# Altium project Arduino Mega 2560.PrjPcb
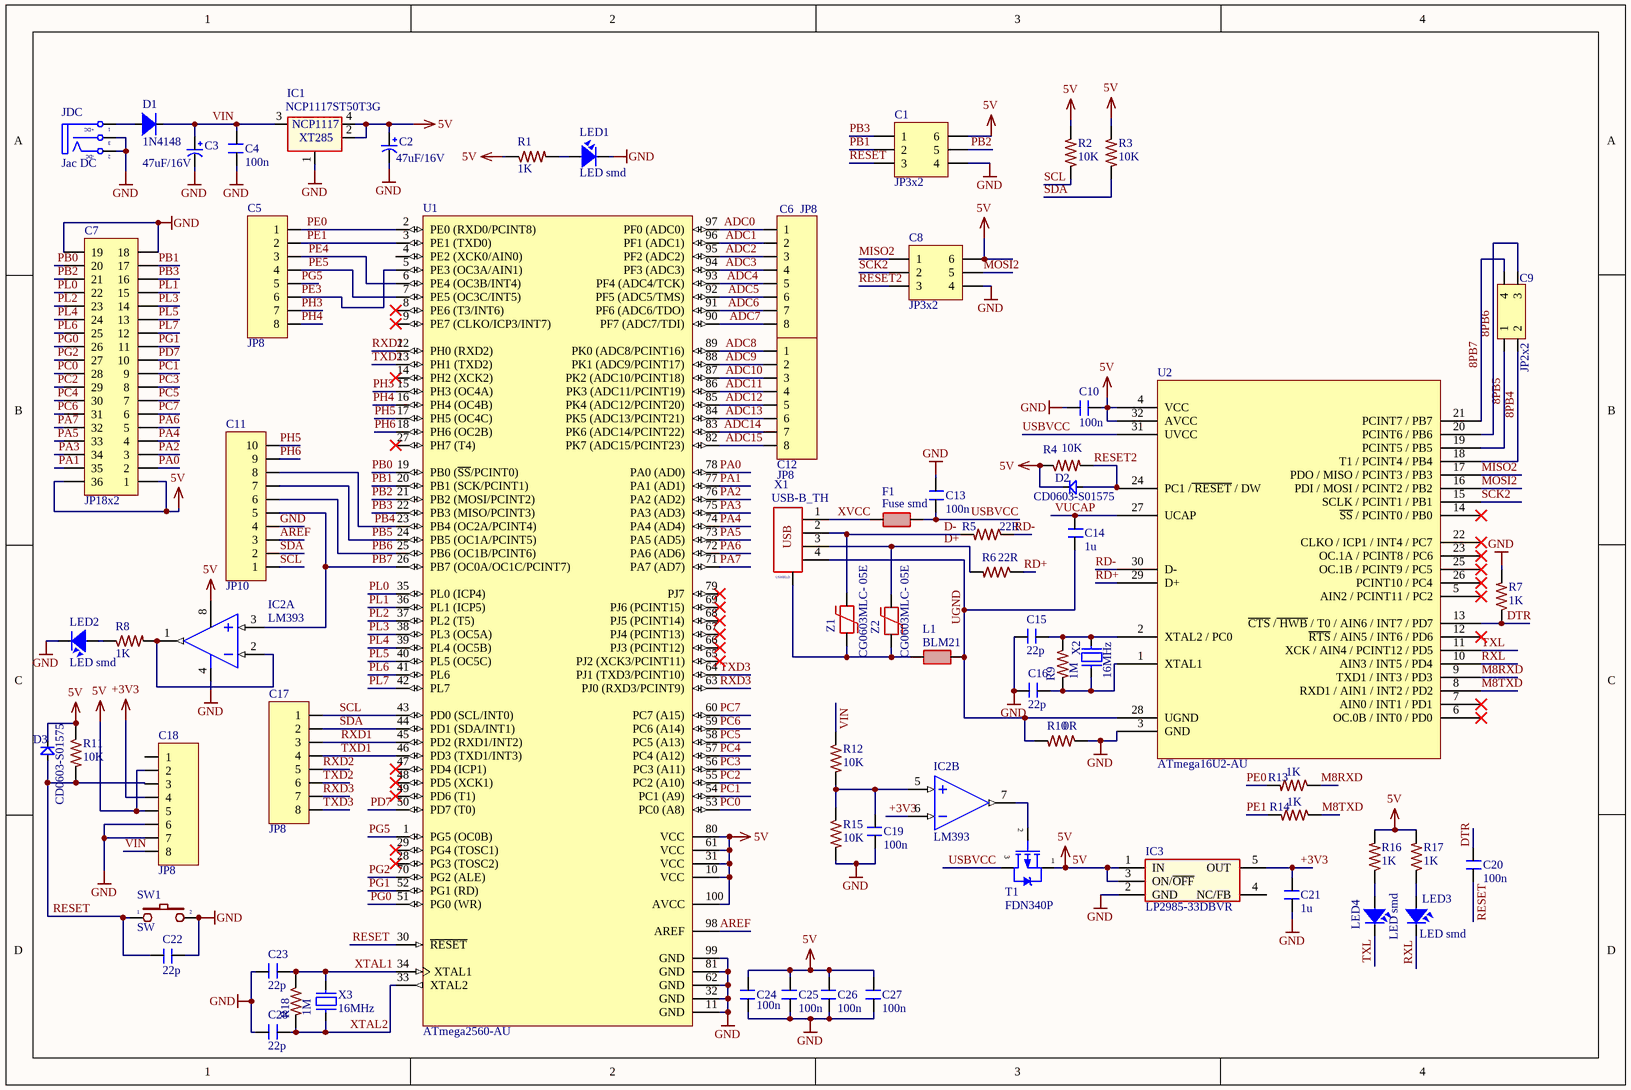
[diagram p0: Sheet_Arduino_Mega_2560.SchDoc]
1 sheet, 68 parts. Net scope: global (net labels, ports and power ports of the same name join across sheets).
Board file: PCB_Arduino_Mega_2560_new.PcbDoc

## Sheet Sheet_Arduino_Mega_2560.SchDoc: Arduino Mega 2560
size 304 x 203 mm; Author: Võ Thái Linh; Organization: HUST; Address1: Số 2, ngõ 17, Lê Thanh Nghị; Address2: Hai Bà Trưng, Hà Nội; Address3: NSW; Address4: Australia 2086; Rule: UNIONINDEX=0|RULEKIND=Clearance|NETSCOPE=DifferentNets|LAYERKIND=SameLayer|NAME=Schematic Clearance Constraint|GAP=10mil|GENERICCLEARANCE=10mil|IGNOREPADTOPADCLEARANCEINFOOTPRINT=FALSE|OBJECTCLEARANCES=ClearanceObj_Arc-ClearanceObj_Hole:0;ClearanceObj_Track-ClearanceObj_Hole:0;ClearanceObj_SMDPad-ClearanceObj_Hole:0;ClearanceObj_THPad-ClearanceObj_Hole:0;ClearanceObj_Via-ClearanceObj_Hole:0;ClearanceObj_Fill-ClearanceObj_Hole:0;ClearanceObj_Poly-ClearanceObj_Hole:0;ClearanceObj_Region-ClearanceObj_Hole:0;ClearanceObj_Text-ClearanceObj_Hole:0|UNIT=Imperial

### Parts
C1  JP3x2  [JP3-D2T]
C2  47uF/16V  [CAP-ALU-SMD-F]
C3  47uF/16V  [CAP-ALU-SMD-F]
C4  100n  [cap 0603]
C5  JP8  [JP8-C1T]
C6  JP8  [JP8-C1T]
C7  JP18x2  [JP18-C2T]
C8  JP3x2  [JP3-D2T]
C9  JP2x2  [JP2-D2T]
C10  100n  [cap 0603]
C11  JP10  [JP10-C1T]
C12  JP8  [JP8-C1T]
C13  100n  [cap 0603]
C14  1u  [cap 0603]
C15  22p  [cap 0603]
C16  22p  [cap 0603]
C17  JP8  [JP8-C1T]
C18  JP8  [JP8-C1T]
C19  100n  [cap 0603]
C20  100n  [cap 0603]
C21  1u  [cap 0603]
C22  22p  [cap 0603]
C23  22p  [cap 0603]
C24  100n  [cap 0603]
C25  100n  [cap 0603]
C26  100n  [cap 0603]
C27  100n  [cap 0603]
C28  22p  [cap 0603]
D1  1N4148  [SOD80_lib]
D2  CD0603-S01575  [CD0603-S01575]
D3  CD0603-S01575  [CD0603-S01575]
F1  Fuse smd  [Fuse_smd]
IC1  NCP1117ST50T3G  [SOT223-4M_apes]
IC2  LM393  [LM393]  (parts A,B of 2)
IC3  LP2985-33DBVR  [SOT23-5]
JDC  Jac DC  [DC0]
L1  BLM21  [BLM21]
LED1  LED smd  [LED-0805-Yellow]
LED2  LED smd  [LED-0805-Red]
LED3  LED smd  [LED-0805-Yellow]
LED4  LED smd  [LED-0805-Yellow]
R1  1K  [RES-SMD-0603]
R2  10K  [RES-SMD-0603]
R3  10K  [RES-SMD-0603]
R4  10K  [RES-SMD-0603]
R5  22R  [RES-SMD-0603]
R6  22R  [RES-SMD-0603]
R7  1K  [RES-SMD-0603]
R8  1K  [RES-SMD-0603]
R9  1M  [RES-SMD-0603]
R10  0R  [RES-SMD-0603]
R11  10K  [RES-SMD-0603]
R12  10K  [RES-SMD-0603]
R13  1K  [RES-SMD-0603]
R14  1K  [RES-SMD-0603]
R15  10K  [RES-SMD-0603]
R16  1K  [RES-SMD-0603]
R17  1K  [RES-SMD-0603]
R18  1M  [RES-SMD-0603]
SW1  SW  [SW-SMD_apes]
T1  FDN340P  [SOT23-231]
U1  ATmega2560-AU  [TQFP100L]
U2  ATmega16U2-AU  [TQFP32]
X1  USB-B_TH  [USB-C2]
X2  16MHz  [XT2-32.768KHz-2_V]
X3  16MHz  [XT2-32.768KHz-2_V]
Z1  CG0603MLC- 05E  [CG0603MLC- 05E]
Z2  CG0603MLC- 05E  [CG0603MLC- 05E]

### Nets
5V: C1.6 C2.1 C7.1 C7.36 C8.6 C10.1 C18.2 C18.5 C24.2 C25.2 C26.2 C27.2 D2.2(K) D3.2(K) IC1.2 IC1.4 IC2.8(+V) IC3.1(IN) IC3.3(ON/~{OFF}) R1.1 R2.1 R3.1 R4.1 R11.1 R16.2 R17.2 T1.1(S) U1.10(VCC) U1.31(VCC) U1.61(VCC) U1.80(VCC) U1.100(AVCC) U2.4(VCC) U2.32(AVCC)
+3V3: C18.4 C21.2 IC2.6(IN-) IC3.5(OUT)
GND: C1.4 C2.2 C3.2 C4.1 C7.18 C7.19 C8.4 C10.2 C11.4 C13.1 C15.1 C16.1 C18.6 C18.7 C19.1 C21.1 C22.1 C23.1 C24.1 C25.1 C26.1 C27.1 C28.1 IC1.1 IC2.4(-V) IC3.2(GND) JDC.2(TN) JDC.3(S) LED1.2 LED2.2 R7.2 R10.1 R15.2 SW1.2 U1.11(GND) U1.32(GND) U1.62(GND) U1.81(GND) U1.99(GND) U2.3(GND)
8PB4: C9.2 U2.18(T1_/_PCINT4_/_PB4)
8PB5: C9.1 U2.19(PCINT5_/_PB5)
8PB6: C9.3 U2.20(PCINT6_/_PB6)
8PB7: C9.4 U2.21(PCINT7_/_PB7)
ADC0: C6.1 U1.97(PF0_(ADC0))
ADC1: C6.2 U1.96(PF1_(ADC1))
ADC2: C6.3 U1.95(PF2_(ADC2))
ADC3: C6.4 U1.94(PF3_(ADC3))
ADC4: C6.5 U1.93(PF4_(ADC4/TCK))
ADC5: C6.6 U1.92(PF5_(ADC5/TMS))
ADC6: C6.7 U1.91(PF6_(ADC6/TDO))
ADC7: C6.8 U1.90(PF7_(ADC7/TDI))
ADC8: C12.1 U1.89(PK0_(ADC8/PCINT16))
ADC9: C12.2 U1.88(PK1_(ADC9/PCINT17))
ADC10: C12.3 U1.87(PK2_(ADC10/PCINT18))
ADC11: C12.4 U1.86(PK3_(ADC11/PCINT19))
ADC12: C12.5 U1.85(PK4_(ADC12/PCINT20))
ADC13: C12.6 U1.84(PK5_(ADC13/PCINT21))
ADC14: C12.7 U1.83(PK6_(ADC14/PCINT22))
ADC15: C12.8 U1.82(PK7_(ADC15/PCINT23))
AREF: C11.3 U1.98(AREF)
D+: R6.2 X1.3 Z2.2
D-: R5.2 X1.2 Z1.2
DTR: C20.1 R7.1 U2.13(~{CTS}_/~{_HWB}_/_T0_/_AIN6_/_INT7_/_PD7)
M8RXD: R13.1 U2.9(TXD1_/_INT3_/_PD3)
M8TXD: R14.1 U2.8(RXD1_/_AIN1_/_INT2_/_PD2)
MISO2: C8.1 U2.17(PDO_/_MISO_/_PCINT3_/_PB3)
MOSI2: C8.5 U2.16(PDI_/_MOSI_/_PCINT2_/_PB2)
PA0: C7.2 U1.78(PA0_(AD0))
PA1: C7.35 U1.77(PA1_(AD1))
PA2: C7.3 U1.76(PA2_(AD2))
PA3: C7.34 U1.75(PA3_(AD3))
PA4: C7.4 U1.74(PA4_(AD4))
PA5: C7.33 U1.73(PA5_(AD5))
PA6: C7.5 U1.72(PA6_(AD6))
PA7: C7.32 U1.71(PA7_(AD7))
PB0: C7.20 U1.19(PB0_(~{SS}/PCINT0))
PB1: C1.2 C7.17 U1.20(PB1_(SCK/PCINT1))
PB2: C1.5 C7.21 U1.21(PB2_(MOSI/PCINT2))
PB3: C1.1 C7.16 U1.22(PB3_(MISO/PCINT3))
PB4: C11.8 U1.23(PB4_(OC2A/PCINT4))
PB5: C11.7 U1.24(PB5_(OC1A/PCINT5))
PB6: C11.6 U1.25(PB6_(OC1B/PCINT6))
PB7: C11.5 IC2.3(IN+) U1.26(PB7_(OC0A/OC1C/PCINT7))
PC0: C7.28 U1.53(PC0_(A8))
PC1: C7.9 U1.54(PC1_(A9))
PC2: C7.29 U1.55(PC2_(A10))
PC3: C7.8 U1.56(PC3_(A11))
PC4: C7.30 U1.57(PC4_(A12))
PC5: C7.7 U1.58(PC5_(A13))
PC6: C7.31 U1.59(PC6_(A14))
PC7: C7.6 U1.60(PC7_(A15))
PD7: C7.10 U1.50(PD7_(T0))
PE0: C5.1 R13.2 U1.2(PE0_(RXD0/PCINT8))
PE1: C5.2 R14.2 U1.3(PE1_(TXD0))
PE3: C5.6 U1.5(PE3_(OC3A/AIN1))
PE4: C5.3 U1.6(PE4_(OC3B/INT4))
PE5: C5.4 U1.7(PE5_(OC3C/INT5))
PG0: C7.26 U1.51(PG0_(WR))
PG1: C7.11 U1.52(PG1_(RD))
PG2: C7.27 U1.70(PG2_(ALE))
PG5: C5.5 U1.1(PG5_(OC0B))
PH3: C5.7 U1.15(PH3_(OC4A))
PH4: C5.8 U1.16(PH4_(OC4B))
PH5: C11.10 U1.17(PH5_(OC4C))
PH6: C11.9 U1.18(PH6_(OC2B))
PL0: C7.22 U1.35(PL0_(ICP4))
PL1: C7.15 U1.36(PL1_(ICP5))
PL2: C7.23 U1.37(PL2_(T5))
PL3: C7.14 U1.38(PL3_(OC5A))
PL4: C7.24 U1.39(PL4_(OC5B))
PL5: C7.13 U1.40(PL5_(OC5C))
PL6: C7.25 U1.41(PL6)
PL7: C7.12 U1.42(PL7)
RD+: R6.1 U2.29(D+)
RD-: R5.1 U2.30(D-)
RESET: C1.3 C18.3 C20.2 C22.2 D3.1(A) R11.2 SW1.1 U1.30(~{RESET})
RESET2: C8.3 D2.1(A) R4.2 U2.24(PC1_/~{_RESET}_/_DW)
RXD1: C17.3 U1.45(PD2_(RXD1/INT2))
RXD2: C17.5 U1.12(PH0_(RXD2))
RXD3: C17.7 U1.63(PJ0_(RXD3/PCINT9))
RXL: LED3.2 U2.10(AIN3_/_INT5_/_PD4)
SCK2: C8.2 U2.15(SCLK_/_PCINT1_/_PB1)
SCL: C11.1 C17.1 R2.2 U1.43(PD0_(SCL/INT0))
SDA: C11.2 C17.2 R3.2 U1.44(PD1_(SDA/INT1))
TXD1: C17.4 U1.46(PD3_(TXD1/INT3))
TXD2: C17.6 U1.13(PH1_(TXD2))
TXD3: C17.8 U1.64(PJ1_(TXD3/PCINT10))
TXL: LED4.2 U2.11(XCK_/_AIN4_/_PCINT12_/_PD5)
UGND: C14.2 L1.2 R10.2 U2.28(UGND) X1.4
USBVCC: C13.2 F1.2 T1.3(D) U2.31(UVCC)
VIN: C3.1 C4.2 C18.8 D1.K IC1.3 R12.1
VUCAP: C14.1 U2.27(UCAP)
XTAL1: C23.2 R18.1 U1.34(XTAL1) X3.2
XTAL2: C28.2 R18.2 U1.33(XTAL2) X3.1
XVCC: F1.1 X1.1
NetC15_2: C15.2 R9.1 U2.2(XTAL2_/_PC0) X2.2
NetC16_2: C16.2 R9.2 U2.1(XTAL1) X2.1
NetC19_2: C19.2 IC2.5(IN+) R12.2 R15.1
NetD1_A: D1.A JDC.1(T)
NetIC2_1: IC2.1(OUT) IC2.2(IN-) R8.2
NetIC2_7: IC2.7(OUT) T1.2(G)
NetL1_1: L1.1 X1.5 Z1.1 Z2.1
NetLED1_1: LED1.1 R1.2
NetLED2_1: LED2.1 R8.1
NetLED3_1: LED3.1 R17.1
NetLED4_1: LED4.1 R16.1

Not connected (* = marked no-connect by the designer): C18 1; IC3 4(NC/FB); U1 4(PE2_(XCK0/AIN0)) 8(PE6_(T3/INT6))* 9(PE7_(CLKO/ICP3/INT7))* 14(PH2_(XCK2))* 27(PH7_(T4))* 28(PG3_(TOSC2))* 29(PG4_(TOSC1))* 47(PD4_(ICP1))* 48(PD5_(XCK1))* 49(PD6_(T1))* 65(PJ2_(XCK3/PCINT11))* 66(PJ3_(PCINT12))* 67(PJ4_(PCINT13))* 68(PJ5_(PCINT14))* 69(PJ6_(PCINT15))* 79(PJ7)*; U2 5(AIN2_/_PCINT11_/_PC2)* 6(OC.0B_/_INT0_/_PD0)* 7(AIN0_/_INT1_/_PD1)* 12(~{RTS}_/_AIN5_/_INT6_/_PD6)* 14(~{SS}_/_PCINT0_/_PB0)* 22(CLKO_/_ICP1_/_INT4_/_PC7)* 23(OC.1A_/_PCINT8_/_PC6)* 25(OC.1B_/_PCINT9_/_PC5)* 26(PCINT10_/_PC4)*

### Notes on the sheet
- Title
- Size:
- Date:
- A4
- Number:
- Time:
- Revision:
- Sheet
- of
- Author:
- File:
- (in symbol DCIN) +DC; -DC
- (in symbol NCP1117ST50T3G) XT285
- (in symbol USB-B) USB; USHIELD

### Library data of the parts
C1 C8 = JP3x2: WR-PHD 2.54 mm Dual Socket Header; Manufacturer: W¨¹rth Elektronik eiSos GmbH; partNo: 61300621821; ComponentLink1 Description: Manufacturer; ComponentLink2 Description: Datasheet; NoPins: 06; Created Date: 29 March 2013; ComponentLink1URL: http://www.we-online.com; ComponentLink2URL: http://katalog.we-online.de/em/datasheet/6130xx21821.pdf; Created by: Karrer Zheng
C2 C3 = Cap 47uF/16V
C4 C10 C13 C19 C20 C24-C27 = Cap: 100nF±5%/5V; Supplier 1: Digikey; Supplier Part Number 1: 1276-CL21B104KBFXPJETR-ND
C5 C6 C12 C17 C18 = JP8: WR-PHD 2.54 mm Angled Socket Header; Manufacturer: W¨¹rth Elektronik eiSos GmbH; partNo: 613008143121; ComponentLink1 Description: Manufacturer; ComponentLink2 Description: Datasheet; NoPins: 08; Created Date: 29 March 2013; ComponentLink1URL: http://www.we-online.com; ComponentLink2URL: http://katalog.we-online.de/em/datasheet/6130xx143121.pdf; Created by: Karrer Zheng
C7 = JP18x2: WR-PHD 2.54 mm Dual Socket Header; Manufacturer: W¨¹rth Elektronik eiSos GmbH; partNo: 61303621821; ComponentLink1 Description: Manufacturer; ComponentLink2 Description: Datasheet; NoPins: 36; Created Date: 29 March 2013; ComponentLink1URL: http://www.we-online.com; ComponentLink2URL: http://katalog.we-online.de/em/datasheet/6130xx21821.pdf; Created by: Karrer Zheng
C9 = JP2x2: WR-PHD 2.54 mm Dual Socket Header; Manufacturer: W¨¹rth Elektronik eiSos GmbH; partNo: 61300421821; ComponentLink1 Description: Manufacturer; ComponentLink2 Description: Datasheet; NoPins: 04; Created Date: 29 March 2013; ComponentLink1URL: http://www.we-online.com; ComponentLink2URL: http://katalog.we-online.de/em/datasheet/6130xx21821.pdf; Created by: Karrer Zheng
C11 = JP10: WR-PHD 2.54 mm Angled Socket Header; Manufacturer: W¨¹rth Elektronik eiSos GmbH; partNo: 613010143121; ComponentLink1 Description: Manufacturer; ComponentLink2 Description: Datasheet; NoPins: 10; Created Date: 29 March 2013; ComponentLink1URL: http://www.we-online.com; ComponentLink2URL: http://katalog.we-online.de/em/datasheet/6130xx143121.pdf; Created by: Karrer Zheng
C14-C16 C21-C23 C28 = Cap: 0.47uF/1.6kV
D1 = Diode 1N4148
D2 D3 = CD0603-S01575: diode CD0603-S01575
F1 = Fuse_smd
IC1 = NCP1117ST50T3G: NCP1117
IC2 = LM393: Low-Power Dual Operational Amplifier; Value: LM358
IC3 = LP2985
JDC = DCIN: Jac DC input; Value: Jac DC
L1 = BLM21: BLM21 EMI
R1 R5-R10 R13 R14 R16-R18 = RES SMD
R2-R4 R11 R12 R15 = RES SMD: 10K±1%/0.25W; Supplier 1: Minh Hà; Supplier Part Number 1: MH006333
SW1 = SW2: Switch button 2 pin; Value: SW chip 2 pin
T1 = FDN340D
U1 = ATmega2560-AU: 8-bit AVR Microcontroller, 4.5-5.5V, 256KB Flash, 4KB EEPROM, 8KB SRAM, 86 GPIO pins, 100-pin TQFP, Industrial Grade (-40°C to 85°C), Pb-Free; Supplier 1: Digi-Key; Supplier Part Number 1: ATMEGA2560-16AUR-ND
U2 = ATmega16U2-AU: IC MCU 8BIT 16KB FLASH 32TQFP; Manufacturer: Atmel; Core Processor: AVR; Core Size: 8-Bit; Speed: 16MHz; Connectivity: SPI, UART/USART, USB; Peripherals: Brown-out Detect/Reset, POR, PWM, WDT; Number of I/O: 22; Program Memory Size: 16KB (8K x 16); EEPROM Size: 512 x 8; Voltage - Supply (Vcc/Vdd): 2.7 V ~ 5.5 V; Oscillator Type: Internal; .Creator: MM; .Checked PCB: RF; Supplier 1: Digi-Key; Manufacturer Part Number: ATMEGA16U2-AU; RoHS: RoHS Compliant; Category: Integrated Circuits (ICs); Stock 1: 8549; Pricing 1: 1=4.35, 10=3.881, 25=3.4932, 100=3.1826, 250=2.87212, 500=2.57716, 1000=2.1735 (USD); Packaging: Tray; Program Memory Type: FLASH; RAM Size: 512 x 8; Data Converters: -; Operating Temperature: -40°C ~ 85°C; Package / Case: 32-TQFP; Supplier Device Package: 32-TQFP (7x7); ComponentLink1URL: http://www.atmel.com/Images/7799s.pdf; ComponentLink1Description: http://www.atmel.com/Images/7799s.pdf; Supplier Part Number 1: ATMEGA16U2-AU-ND; .Checked SCH: RF
X1 = USB-B
X2 X3 = XT2_1: Crystal, 32.768 KHz, -40 to 85 degC, 3.2 x 1.5 x 0.9 mm SMD; Value: 4Mhz
Z1 Z2 = CG0603MLC- 05E: EMI CG0603MLC- 05E